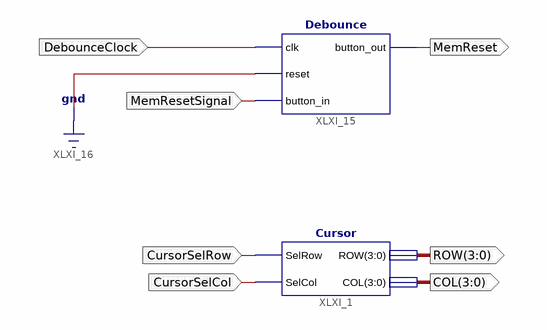
[diagram p0: schematic sheet 1]
// Xilinx ISE schematic InputUnit.sch (spartan6) as structural Verilog: 2 symbols, 7 ports
module InputUnit (
  input  CursorSelRow,
  input  CursorSelCol,
  input  DebounceClock,
  input  MemResetSignal,
  output MemReset,
  output [3:0] ROW,
  output [3:0] COL
);

  Cursor XLXI_1 (.SelRow(CursorSelRow), .SelCol(CursorSelCol), .ROW(ROW), .COL(COL));
  Debounce XLXI_15 (.clk(DebounceClock), .reset(1'b0), .button_in(MemResetSignal), .button_out(MemReset));
endmodule
